# EAGLE design 2x6x1.27mm-pogo-adapter-mk-1.0.0 (EAGLE 9.2.0)
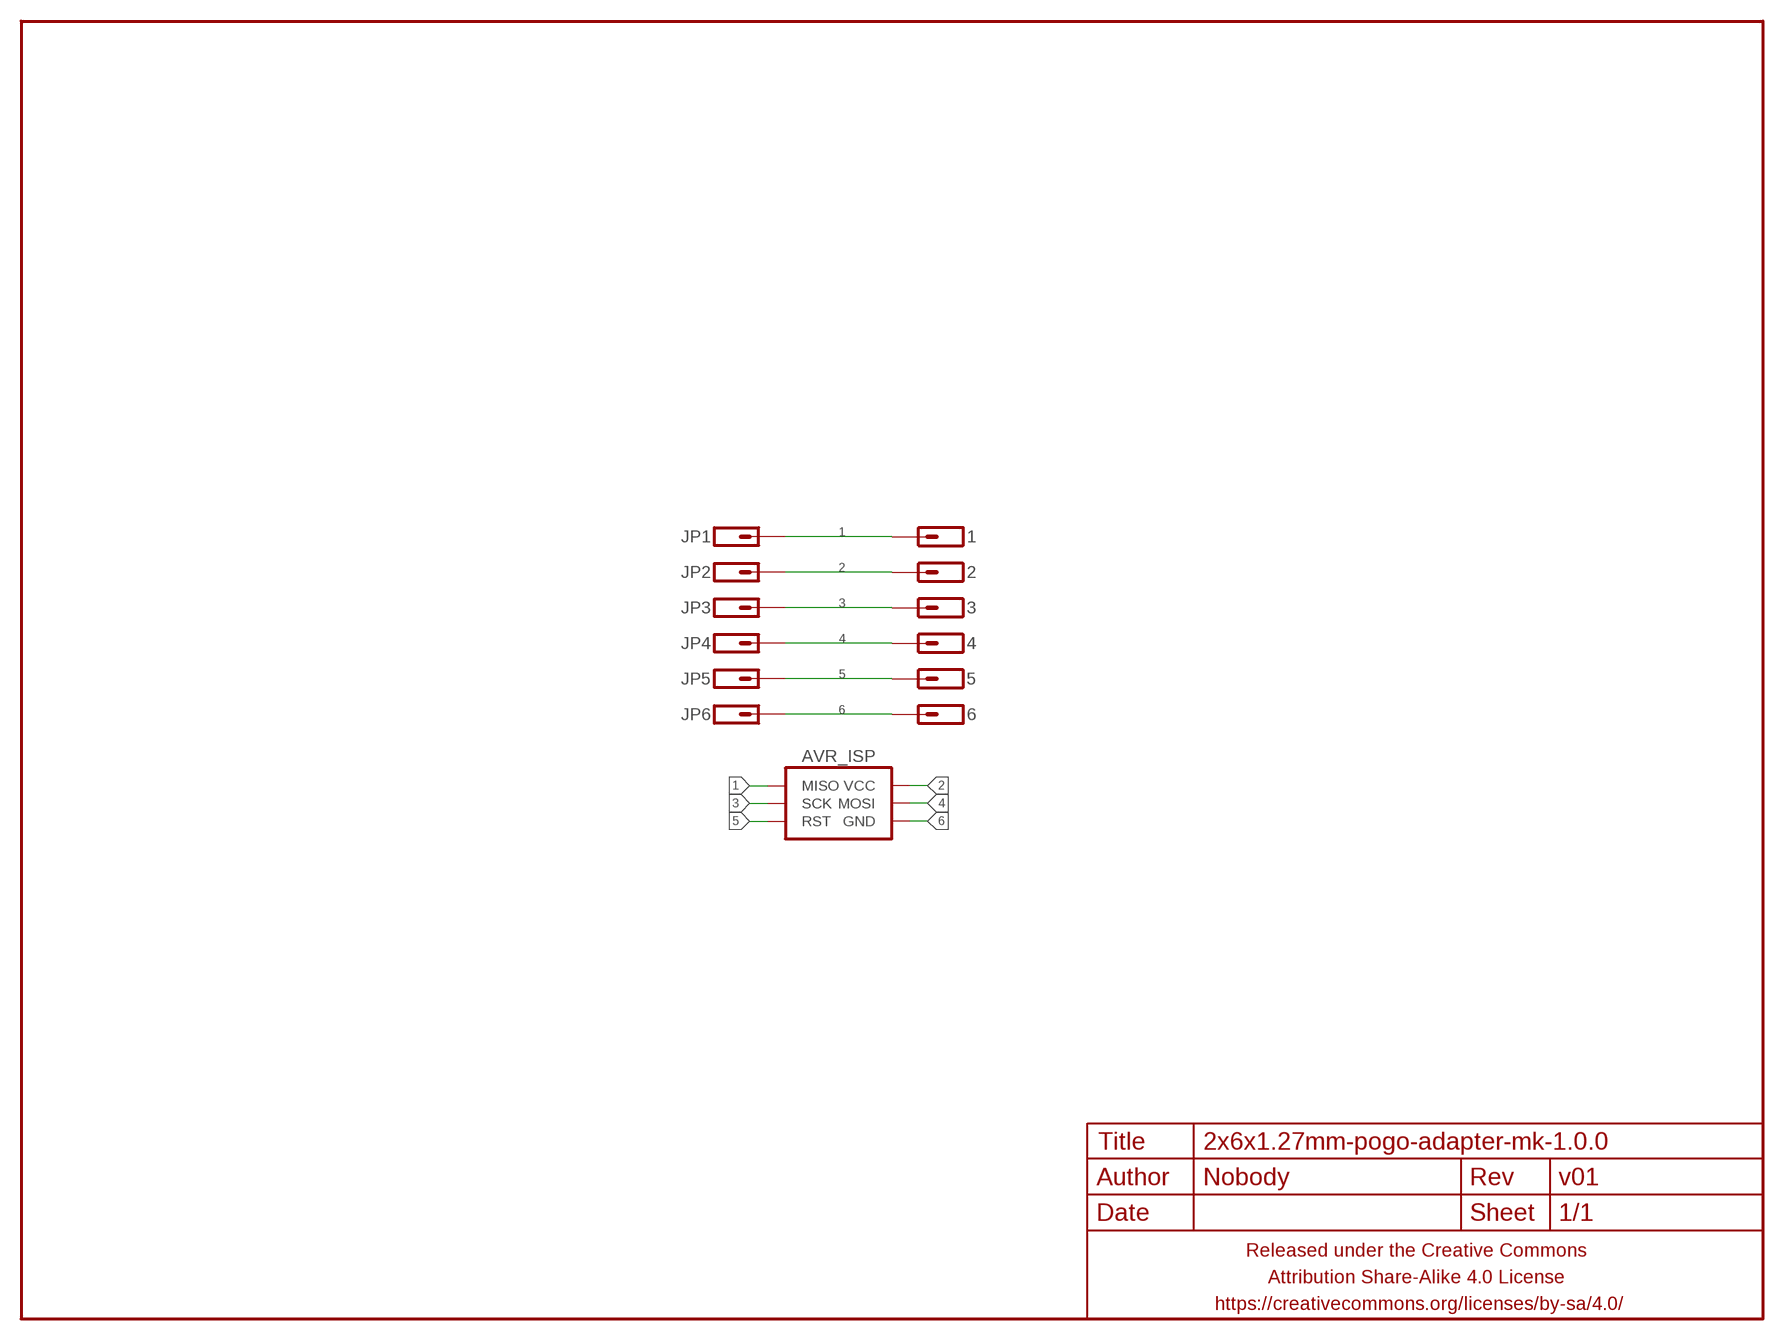
[diagram p0: schematic, sheet 1]

## Parts
1  M01PTH  [1X01]
2  M01PTH  [1X01]
3  M01PTH  [1X01]
4  M01PTH  [1X01]
5  M01PTH  [1X01]
6  M01PTH  [1X01]
AVR_ISP  AVR_SPI_PRG_6PTH-SHROUD-ALT  [2X3-SHROUDED-ALT]
FRAME1  FRAME-LETTERNO_PACKAGE  [DUMMY]
JP1  M01PTH-0.7MM-CIR-NS  [1X01-0.7MM-CIR-NS]
JP2  M01PTH-0.65MM-NS  [1X01_635MM]
JP3  M01PTH-0.65MM-NS  [1X01_635MM]
JP4  M01PTH-0.65MM-NS  [1X01_635MM]
JP5  M01PTH-0.65MM-NS  [1X01_635MM]
JP6  M01PTH-0.65MM-NS  [1X01_635MM]

## Nets
1: 1.1 AVR_ISP.1(MISO) JP1.P$1
2: 2.1 AVR_ISP.2(VCC) JP2.P$1
3: 3.1 AVR_ISP.3(SCK) JP3.P$1
4: 4.1 AVR_ISP.4(MOSI) JP4.P$1
5: 5.1 AVR_ISP.5(RST) JP5.P$1
6: 6.1 AVR_ISP.6(GND) JP6.P$1

## Library data of the parts
1-6 JP1-JP6 = a_parts:M01: Header 1 Standard 1-pin 0.1" header. Use with straight break away headers (SKU : PRT-00116), right angle break away headers (PRT-00553), swiss pins (PRT-00743), machine pins (PRT-00117), and female headers (PRT-00115).
AVR_ISP = a_parts:AVR_SPI_PRG_6: AVR ISP 6 Pin This is the reduced ISP connector for AVR programming. Common on Arduino. This footprint will take up less PCB space and can be used with a 10-pin to 6-pin adapter such as SKU: BOB-08508 **Special note about "TEST_POINT" package. The stop mask is on the top side, so if you want your programming test points to be on the bottom of your board, make sure to place this package on the bottom side of the board. This also ensure that the orientation to program from the bottom side will be correct.
FRAME1 = a_parts:FRAME-LETTER: Schematic Frame Standard 8.5x11 US Letter frame; DESIGNER: Nobody; VERSION: v01

## Board
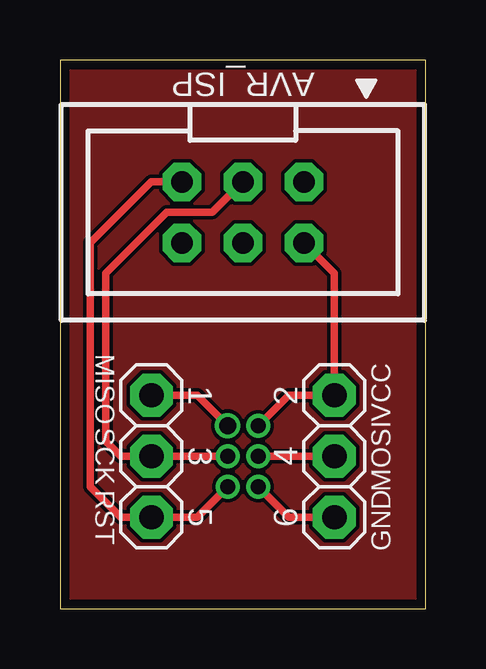
[diagram p1: board, top side]
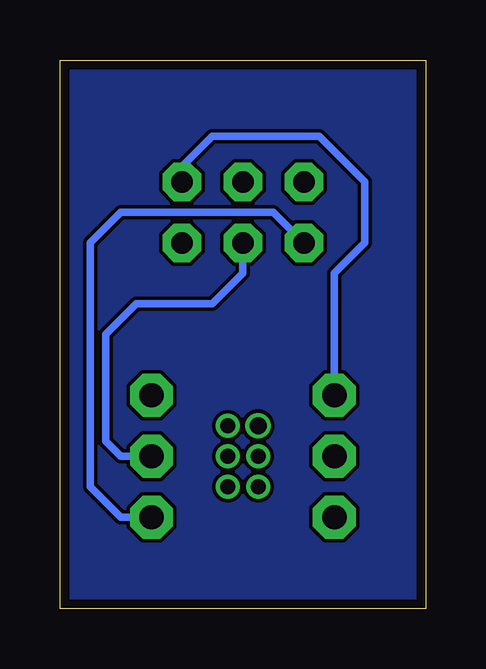
[diagram p2: board, bottom side, seen from below]

Size 15.24 x 22.86 mm. Coordinates in mm from the lower left corner, seen from the top.
Outline: 0,22.86 0,0 15.24,0 15.24,22.86 0,22.86
Copper layers (1*16): Top 0.0356mm / dielectric 1.5011mm / Bottom 0.0356mm
Design rules "LaenPCBOrder_2": minimum track width 6mil, minimum drill 13mil, track to track 6mil, track to pad 6mil, pad to pad 6mil, via to via 6mil, smd to smd 6mil, copper to edge 15mil, drill to drill 6mil, minimum pad ring 7mil, minimum via ring 7mil, stop-mask expansion 3mil, vias tented up to drill 20mil, thermal gap 10mil

### Footprints (pad centres in the part's own frame; a part is rotated, then mirrored left to right if it is on the bottom)
1X01 = drill 1.016 pad 1.778 octagon: 1 0,0
2X3-SHROUDED-ALT = drill 0.9 pad 1.6 octagon: 1 -1.27,2.54; 2 1.27,2.54; 3 -1.27,0; 4 1.27,0; 5 -1.27,-2.54; 6 1.27,-2.54
1X01-0.7MM-CIR-NS = drill 0.7: P$1 0,0
1X01_635MM = drill 0.635: P$1 0,0

### Placement (x,y rotation side)
1  3.81,8.89 270 top
2  11.43,8.89 90 top
3  3.81,6.35 270 top
4  11.43,6.35 90 top
5  3.81,3.81 270 top
6  11.43,3.81 90 top
AVR_ISP  7.62,16.51 270 top
FRAME1  0,0 0 top
JP1  6.99,7.62 0 top
JP2  8.26,7.62 0 top
JP3  6.99,6.35 0 top
JP4  8.26,6.35 0 top
JP5  6.99,5.08 0 top
JP6  8.26,5.08 0 top

### Tracks (layer width: path | path; a pad name or v marks a point on that pad's centre or on a via)
1
  Top 0.305: JP1.P$1 5.71,8.89 1.1
  Bottom 0.305: 1.1 3.81,13.97 2.54,15.24 2.54,17.78 4.45,19.68 8.89,19.68 10.16,18.41 AVR_ISP.1
2
  Top 0.305: AVR_ISP.2 11.43,13.97 2.1 9.53,8.89 JP2.P$1
3
  Top 0.305: AVR_ISP.3 6.35,16.51 4.45,16.51 1.91,13.97 1.91,6.99 2.54,6.35 3.1 JP3.P$1
4
  Top 0.305: JP4.P$1 4.1
  Bottom 0.305: 4.1 12.7,6.35 13.34,6.99 13.34,11.43 12.06,12.7 8.89,12.7 7.62,13.97 AVR_ISP.4
5
  Top 0.305: AVR_ISP.5 3.81,17.78 1.27,15.24 1.27,5.08 2.54,3.81 5.1 5.71,3.81 JP5.P$1
6
  Top 0.305: JP6.P$1 9.53,3.81 6.1
  Bottom 0.305: AVR_ISP.6 6.35,16.51 12.7,16.51 13.97,15.24 13.97,5.08 12.7,3.81 6.1
PAD
  pour Top: 0,0 15.24,0 15.24,22.86 0,22.86
  pour Bottom: 0,0 15.24,0 15.24,22.86 0,22.86

### Text on the board
tNames: MISO | VCC | SCK | MOSI | RST | GND